# Altium schematic sheet CE842170047_SHEET5.SchDoc
size Tabloid; SheetNumber: 4; SheetTotal: 5; PageSetup: Record=PageOptions|CenterHorizontal=True|CenterVertical=True|PrintScale=0.70|XCorrection=1.00|YCorrection=1.00|PrintKind=1|BorderSize=5000000|LeftOffset=0|BottomOffset=0|Orientation=2|PaperLength=1000|PaperWidth=1000|Scale=100|PaperSource=7|PrintQuality=-4|MediaType=1|DitherType=10|PaperKind=8 1/2x11|PrintScaleMode=1; SPICEModelCacheMIYJXAQF: <root> / <DocumentId>MIYJXAQF</DocumentId> / </root>
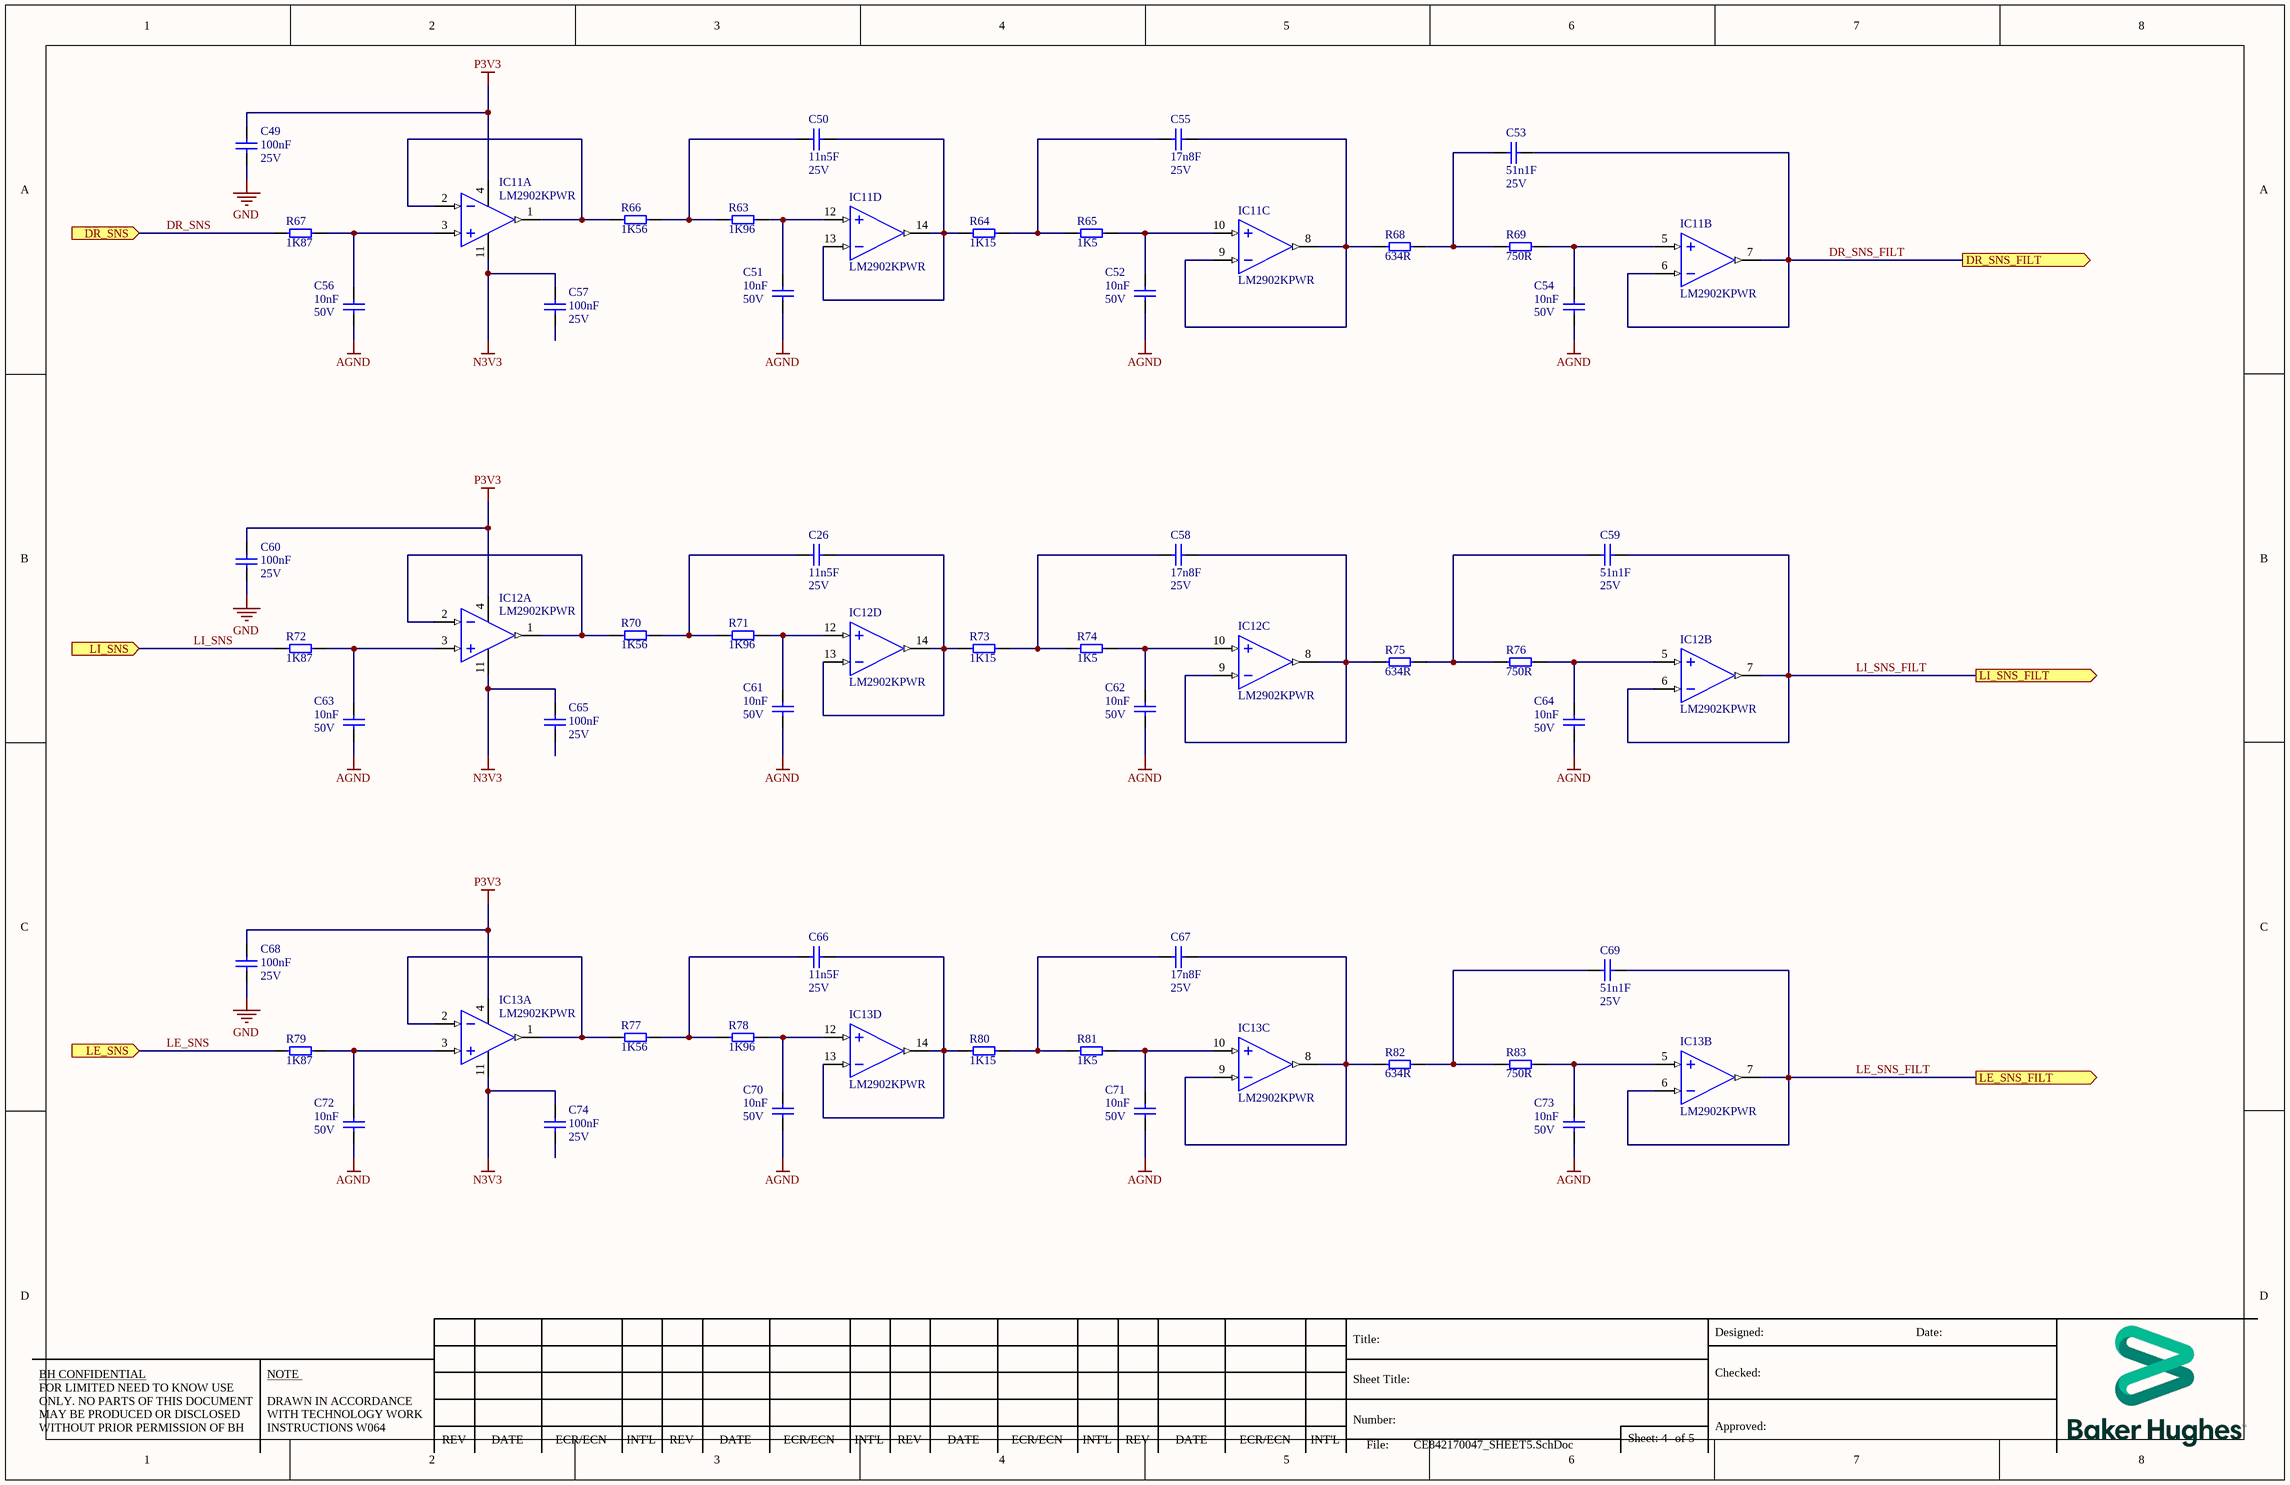
[diagram p0: CE842170047_SHEET5.SchDoc]

## Parts
C26  value 11n5F  Voltage: 25V  [C0603]  (hidden comment: KK/96159/0407)
C49  value 100nF  Voltage: 25V  [C0603]  (hidden comment: KK/96159/4501)
C50  value 11n5F  Voltage: 25V  [C0603]  (hidden comment: KK/96159/0407)
C51  value 10nF  Voltage: 50V  [C0603]  (hidden comment: KK/96159/0401)
C52  value 10nF  Voltage: 50V  [C0603]  (hidden comment: KK/96159/0401)
C53  value 51n1F  Voltage: 25V  [C0603]  (hidden comment: KK/96159/0469)
C54  value 10nF  Voltage: 50V  [C0603]  (hidden comment: KK/96159/0401)
C55  value 17n8F  Voltage: 25V  [C0603]  (hidden comment: KK/96159/0425)
C56  value 10nF  Voltage: 50V  [C0603]  (hidden comment: KK/96159/0401)
C57  value 100nF  Voltage: 25V  [C0603]  (hidden comment: KK/96159/4501)
C58  value 17n8F  Voltage: 25V  [C0603]  (hidden comment: KK/96159/0425)
C59  value 51n1F  Voltage: 25V  [C0603]  (hidden comment: KK/96159/0469)
C60  value 100nF  Voltage: 25V  [C0603]  (hidden comment: KK/96159/4501)
C61  value 10nF  Voltage: 50V  [C0603]  (hidden comment: KK/96159/0401)
C62  value 10nF  Voltage: 50V  [C0603]  (hidden comment: KK/96159/0401)
C63  value 10nF  Voltage: 50V  [C0603]  (hidden comment: KK/96159/0401)
C64  value 10nF  Voltage: 50V  [C0603]  (hidden comment: KK/96159/0401)
C65  value 100nF  Voltage: 25V  [C0603]  (hidden comment: KK/96159/4501)
C66  value 11n5F  Voltage: 25V  [C0603]  (hidden comment: KK/96159/0407)
C67  value 17n8F  Voltage: 25V  [C0603]  (hidden comment: KK/96159/0425)
C68  value 100nF  Voltage: 25V  [C0603]  (hidden comment: KK/96159/4501)
C69  value 51n1F  Voltage: 25V  [C0603]  (hidden comment: KK/96159/0469)
C70  value 10nF  Voltage: 50V  [C0603]  (hidden comment: KK/96159/0401)
C71  value 10nF  Voltage: 50V  [C0603]  (hidden comment: KK/96159/0401)
C72  value 10nF  Voltage: 50V  [C0603]  (hidden comment: KK/96159/0401)
C73  value 10nF  Voltage: 50V  [C0603]  (hidden comment: KK/96159/0401)
C74  value 100nF  Voltage: 25V  [C0603]  (hidden comment: KK/96159/4501)
IC11  MF_PartNumber: LM2902KPWR  [TSSOP-14]  (hidden comment: LM2902)  (parts A,B,C,D of 4)
IC12  MF_PartNumber: LM2902KPWR  [TSSOP-14]  (hidden comment: LM2902)  (parts A,B,C,D of 4)
IC13  MF_PartNumber: LM2902KPWR  [TSSOP-14]  (hidden comment: LM2902)  (parts A,B,C,D of 4)
R63  value 1K96  [R0603]  (hidden comment: KK/96059/0529)
R64  value 1K15  [R0603]  (hidden comment: KK/96059/0507)
R65  value 1K5  [R0603]  (hidden comment: KK/96059/0518)
R66  value 1K56  [R0603]  (hidden comment: KK/96059/0519)
R67  value 1K87  [R0603]  (hidden comment: KK/96059/0527)
R68  value 634R  [R0603]  (hidden comment: KK/96059/0478)
R69  value 750R  [R0603]  (hidden comment: KK/96059/0485)
R70  value 1K56  [R0603]  (hidden comment: KK/96059/0519)
R71  value 1K96  [R0603]  (hidden comment: KK/96059/0529)
R72  value 1K87  [R0603]  (hidden comment: KK/96059/0527)
R73  value 1K15  [R0603]  (hidden comment: KK/96059/0507)
R74  value 1K5  [R0603]  (hidden comment: KK/96059/0518)
R75  value 634R  [R0603]  (hidden comment: KK/96059/0478)
R76  value 750R  [R0603]  (hidden comment: KK/96059/0485)
R77  value 1K56  [R0603]  (hidden comment: KK/96059/0519)
R78  value 1K96  [R0603]  (hidden comment: KK/96059/0529)
R79  value 1K87  [R0603]  (hidden comment: KK/96059/0527)
R80  value 1K15  [R0603]  (hidden comment: KK/96059/0507)
R81  value 1K5  [R0603]  (hidden comment: KK/96059/0518)
R82  value 634R  [R0603]  (hidden comment: KK/96059/0478)
R83  value 750R  [R0603]  (hidden comment: KK/96059/0485)

## Ports
DR_SNS (in), DR_SNS_FILT (out), LE_SNS (in), LE_SNS_FILT (out), LI_SNS (in), LI_SNS_FILT (out)

## Nets
AGND: C51.2 C52.2 C54.2 C56.2 C61.2 C62.2 C63.2 C64.2 C70.2 C71.2 C72.2 C73.2
GND: C49.2 C60.2 C68.2
N3V3: C57.1 C65.1 C74.1 IC11.11(GND) IC12.11(GND) IC13.11(GND)
P3V3: C49.1 C60.1 C68.1 IC11.4(VCC) IC12.4(VCC) IC13.4(VCC)
DR_SNS: R67.1 ; port DR_SNS
DR_SNS_FILT: C53.1 IC11.6(2IN-) IC11.7(2OUT) ; port DR_SNS_FILT
LE_SNS: R79.1 ; port LE_SNS
LE_SNS_FILT: C69.1 IC13.6(2IN-) IC13.7(2OUT) ; port LE_SNS_FILT
LI_SNS: R72.1 ; port LI_SNS
LI_SNS_FILT: C59.1 IC12.6(2IN-) IC12.7(2OUT) ; port LI_SNS_FILT
NetC26_1: C26.1 R70.2 R71.1
NetC26_2: C26.2 IC12.13(4IN-) IC12.14(4OUT) R73.1
NetC50_1: C50.1 R63.1 R66.2
NetC50_2: C50.2 IC11.13(4IN-) IC11.14(4OUT) R64.1
NetC51_1: C51.1 IC11.12(4IN+) R63.2
NetC52_1: C52.1 IC11.10(3IN+) R65.2
NetC53_2: C53.2 R68.2 R69.1
NetC54_1: C54.1 IC11.5(2IN+) R69.2
NetC55_1: C55.1 R64.2 R65.1
NetC55_2: C55.2 IC11.8(3OUT) IC11.9(3IN-) R68.1
NetC56_1: C56.1 IC11.3(1IN+) R67.2
NetC58_1: C58.1 R73.2 R74.1
NetC58_2: C58.2 IC12.8(3OUT) IC12.9(3IN-) R75.1
NetC59_2: C59.2 R75.2 R76.1
NetC61_1: C61.1 IC12.12(4IN+) R71.2
NetC62_1: C62.1 IC12.10(3IN+) R74.2
NetC63_1: C63.1 IC12.3(1IN+) R72.2
NetC64_1: C64.1 IC12.5(2IN+) R76.2
NetC66_1: C66.1 R77.2 R78.1
NetC66_2: C66.2 IC13.13(4IN-) IC13.14(4OUT) R80.1
NetC67_1: C67.1 R80.2 R81.1
NetC67_2: C67.2 IC13.8(3OUT) IC13.9(3IN-) R82.1
NetC69_2: C69.2 R82.2 R83.1
NetC70_1: C70.1 IC13.12(4IN+) R78.2
NetC71_1: C71.1 IC13.10(3IN+) R81.2
NetC72_1: C72.1 IC13.3(1IN+) R79.2
NetC73_1: C73.1 IC13.5(2IN+) R83.2
NetIC11_1: IC11.1(1OUT) IC11.2(1IN-) R66.1
NetIC12_1: IC12.1(1OUT) IC12.2(1IN-) R70.1
NetIC13_1: IC13.1(1OUT) IC13.2(1IN-) R77.1

Not connected (* = marked no-connect by the designer): C57 2; C65 2; C74 2

## Notes on the sheet
- BH CONFIDENTIAL
- NOTE
- Title:
- Sheet Title:
- Designed:
- Checked:
- Date:
- DRAWN IN ACCORDANCE WITH TECHNOLOGY WORK INSTRUCTIONS W064
- REV
- DATE
- ECR/ECN
- INT'L
- Number:
- Approved:
- FOR LIMITED NEED TO KNOW USE ONLY. NO PARTS OF THIS DOCUMENT MAY BE PRODUCED OR DISCLOSED WITHOUT PRIOR PERMISSION OF BH
- File:
- Sheet:
- of

## Library data of the parts
C26 C50 C66 = KK/96159/0407: CAPACITOR CER 0603 11n5F 10% 25V X5R; ID: 574; PII_PartNumber: KK/96159/0407; Pins: 2; Tolerance: 10%
C49 C57 C60 C65 C68 C74 = KK/96159/4501: CAPACITOR_100nF_+10%_25V_603; ID: 185; Tolerance: 10%; PII_PartNumber: KK/96159/4501; Pins: 2
C51 C52 C54 C56 C61-C64 C70-C73 = KK/96159/0401: CAPACITOR CERAMIC 0603 50V 10% X7R 10nF; ID: 571; PII_PartNumber: KK/96159/0401; Pins: 2; Tolerance: 10%
C53 C59 C69 = KK/96159/0469: CAPACITOR CER 0603 51n1F 10% 25V X5R; ID: 573; PII_PartNumber: KK/96159/0469; Pins: 2; Tolerance: 10%
C55 C58 C67 = KK/96159/0425: CAPACITOR CER 0603 17n8F 10% 25V X5R; ID: 575; PII_PartNumber: KK/96159/0425; Pins: 2; Tolerance: 10%
IC11-IC13 = KK/95300/0171: IC,QUAD OP.AMP,TSSOP-14,ST,LM2902KPWR; Manufacturer: ROHM; ID: 111; Voltage: 3V to 32V; Value: 1.2MHz; PII_PartNumber: KK/95300/0171; Pins: 14; Temperature: -40 +125C
R63 R71 R78 = KK/96059/0529: RESISTOR 0603 0.063W 1% 1K96; ID: 1395; PII_PartNumber: KK/96059/0529; Pins: 2; Tolerance: 1%; Power: 0.063W
R64 R73 R80 = KK/96059/0507: RESISTOR 0603 0.063W 1% 1K15; ID: 1399; PII_PartNumber: KK/96059/0507; Pins: 2; Tolerance: 1%; Power: 0.063W
R65 R74 R81 = KK/96059/0518: RESISTOR 0603 0.1W 1% 1K5; ID: 1406; Power: 0.063W; PII_PartNumber: KK/96059/0518; Pins: 2; Tolerance: 1%
R66 R70 R77 = KK/96059/0519: RESISTOR 0603 0.063W 1% 1K56; ID: 1398; PII_PartNumber: KK/96059/0519; Pins: 2; Tolerance: 1%; Power: 0.063W
R67 R72 R79 = KK/96059/0527: RESISTOR 0603 0.063W 1% 1K87; ID: 1397; PII_PartNumber: KK/96059/0527; Pins: 2; Tolerance: 1%; Power: 0.063W
R68 R75 R82 = KK/96059/0478: RESISTOR 0603 0.063W 1% 634R; ID: 1401; PII_PartNumber: KK/96059/0478; Pins: 2; Tolerance: 1%; Power: 0.063W
R69 R76 R83 = KK/96059/0485: RESISTOR 0603 0.063W 1% 750R; ID: 1400; PII_PartNumber: KK/96059/0485; Pins: 2; Tolerance: 1%; Power: 0.063W